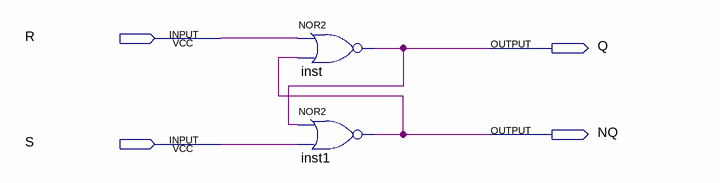
[diagram p0: schematic sheet]
// Quartus schematic latchrs.bdf as structural Verilog: 2 symbols, 4 pins
module latchrs (
  input  R,
  input  S,
  output Q,
  output NQ
);

  nor inst (Q, R, NQ);
  nor inst1 (NQ, Q, S);
endmodule
